# Altium schematic sheet COMMUNICATION_INTERFACE.SchDoc
size A3; SheetNumber: 5; SheetTotal: 6
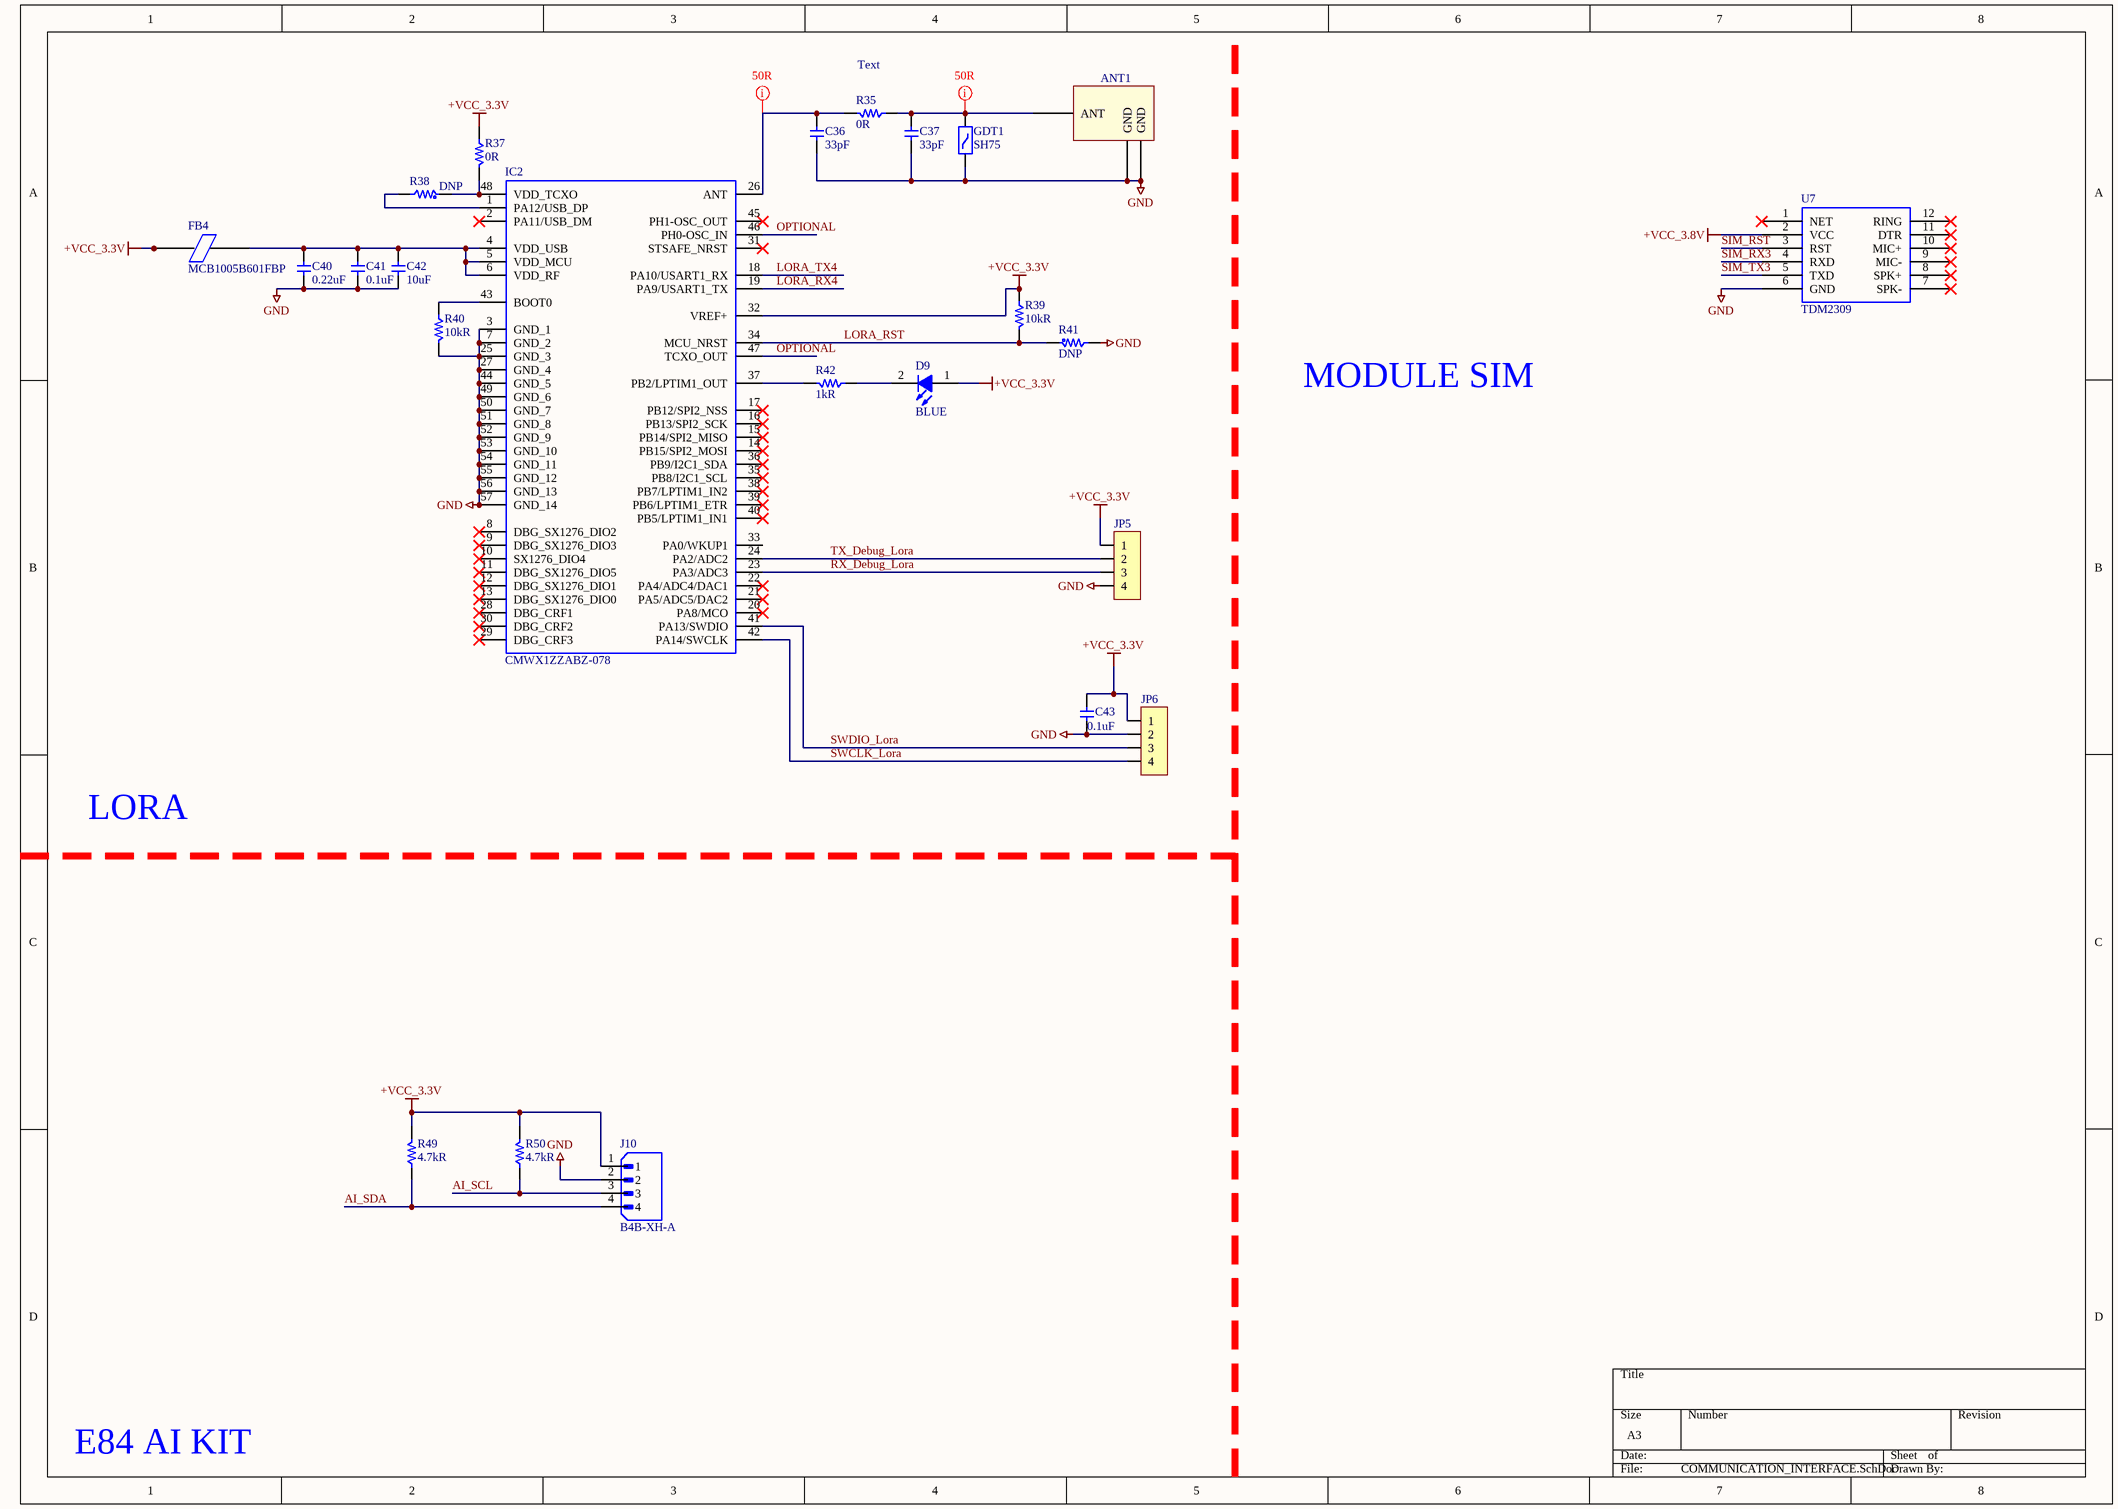
[diagram p0: COMMUNICATION_INTERFACE.SchDoc]

## Parts
ANT1  Anten SMD  [20279-001E-01]  (value not drawn)
C36  33pF  [CAP 0402 (1005)]
C37  33pF  [CAP 0402 (1005)]
C40  0.22uF  [CAP 0402 (1005)]
C41  0.1uF  [CAP 0402 (1005)]
C42  10uF  [CAP 0603 (1608)]
C43  0.1uF  [CAP 0402 (1005)]
D9  BLUE  [LED0402 BLUE]
FB4  MCB1005B601FBP  [FB 0402 (1005)]
GDT1  SH75  [GDT]
IC2  CMWX1ZZABZ-078  [CMWX1ZZABZ-078]
J10  B4B-XH-A  [JST_B4B-XH-A]
JP5  JP 1x4 2.54  [JP 1X4 DT]  (value not drawn)
JP6  JP 1x4 2.54  [JP 1X4 DT]  (value not drawn)
R35  0R  [RES 0603 (1608)]
R37  0R  [RES 0603 (1608)]
R38  DNP  [RES 0603 (1608)]
R39  10kR  [RES 0402 (1005)]
R40  10kR  [RES 0402 (1005)]
R41  DNP  [RES 0402 (1005)]
R42  1kR  [RES 0402 (1005)]
R49  4.7kR  [RES 0402 (1005)]
R50  4.7kR  [RES 0402 (1005)]
U7  TDM2309  [MODULE SIM SIM800L]

## Nets
+VCC_3.3V: C43.1 D9.1(A) FB4.1 IC2.32(VREF+) J10.1 JP5.1 JP6.1 R37.2 R39.2 R49.1 R50.1
+VCC_3.8V: U7.2(VCC)
GND: ANT1.1(GND) ANT1.3(GND) C36.2 C37.2 C40.2 C41.2 C42.2 C43.2 GDT1.1 IC2.3(GND_1) IC2.7(GND_2) IC2.25(GND_3) IC2.27(GND_4) IC2.44(GND_5) IC2.49(GND_6) IC2.50(GND_7) IC2.51(GND_8) IC2.52(GND_9) IC2.53(GND_10) IC2.54(GND_11) IC2.55(GND_12) IC2.56(GND_13) IC2.57(GND_14) J10.2 JP5.4 JP6.2 R40.1 R41.2 U7.6(GND)
AI_SCL: J10.3 R50.2
AI_SDA: J10.4 R49.2
LORA_RST: IC2.34(MCU_NRST) R39.1 R41.1
LORA_RX4: IC2.19(PA9/USART1_TX)
LORA_TX4: IC2.18(PA10/USART1_RX)
OPTIONAL: IC2.46(PH0-OSC_IN) IC2.47(TCXO_OUT)
RX_Debug_Lora: IC2.23(PA3/ADC3) JP5.3
SIM_RST: U7.3(RST)
SIM_RX3: U7.4(RXD)
SIM_TX3: U7.5(TXD)
SWCLK_Lora: IC2.42(PA14/SWCLK) JP6.4
SWDIO_Lora: IC2.41(PA13/SWDIO) JP6.3
TX_Debug_Lora: IC2.24(PA2/ADC2) JP5.2
NetANT1_2: ANT1.2(ANT) C37.1 GDT1.2 R35.2
NetC36_1: C36.1 IC2.26(ANT) R35.1
NetC40_1: C40.1 C41.1 C42.1 FB4.2 IC2.4(VDD_USB) IC2.5(VDD_MCU) IC2.6(VDD_RF)
NetD9_2: D9.2(K) R42.2
NetIC2_1: IC2.1(PA12/USB_DP) R38.2
NetIC2_37: IC2.37(PB2/LPTIM1_OUT) R42.1
NetIC2_43: IC2.43(BOOT0) R40.2
NetIC2_48: IC2.48(VDD_TCXO) R37.1 R38.1

Not connected (* = marked no-connect by the designer): IC2 2(PA11/USB_DM)* 8(DBG_SX1276_DIO2)* 9(DBG_SX1276_DIO3)* 10(SX1276_DIO4)* 11(DBG_SX1276_DIO5)* 12(DBG_SX1276_DIO1)* 13(DBG_SX1276_DIO0)* 14(PB15/SPI2_MOSI)* 15(PB14/SPI2_MISO)* 16(PB13/SPI2_SCK)* 17(PB12/SPI2_NSS)* 20(PA8/MCO)* 21(PA5/ADC5/DAC2)* 22(PA4/ADC4/DAC1)* 28(DBG_CRF1)* 29(DBG_CRF3)* 30(DBG_CRF2)* 31(STSAFE_NRST)* 33(PA0/WKUP1) 35(PB8/I2C1_SCL)* 36(PB9/I2C1_SDA)* 38(PB7/LPTIM1_IN2)* 39(PB6/LPTIM1_ETR)* 40(PB5/LPTIM1_IN1)* 45(PH1-OSC_OUT)*; U7 1(NET)* 7(SPK-)* 8(SPK+)* 9(MIC-)* 10(MIC+)* 11(DTR)* 12(RING)*

## Layout directives
mark named 50R: NetANT1_2, NetC36_1

## Notes on the sheet
- Text
- MODULE SIM
- LORA
- E84 AI KIT

## Library data of the parts
ANT1 = Antenna SMD
C36 C37 = CAP0402 33pF 50V: 50V 33pF NP0 ±5% 0402 Multilayer Ceramic Capacitors MLCC - SMD/SMT ROHS; Manufacturer: YAGEO; Manufacturer Part Number: CC0402JRNPO9BN330; Supplier: LCSC electronics; Unit Price: $0.001
C40 = CAP0402 0.22uF 35V: 35V 0.22uF X5R ±10% 0402 Multilayer Ceramic Capacitors MLCC - SMD/SMT ROHS; Manufacturer: Murata Electronics; Manufacturer Part Number: GRT155R6YA224KE01D; Supplier: LCSC electronics; Unit Price: US$ 0.0130
C41 C43 = CAP0402 0.1uF 50V: 50V 100nF ±10% 0402 Multilayer Ceramic Capacitors MLCC - SMD/SMT ROHS; Manufacturer: Samwha Capacitor; Manufacturer Part Number: CS1005X7R104K500NR; Supplier: LCSC electronics; Unit Price: $0.0017
C42 = CAP0603 10uF 25V: 25V 10uF X5R ±20% 0603 Multilayer Ceramic Capacitors MLCC - SMD/SMT ROHS; Manufacturer: Chinocera; Manufacturer Part Number: HGC0603R5106M250NTHJ; Supplier: LCSC electronics; Unit Price: $0.0199
D9 = LED BLUE 0402: blue 0402 Light Emitting Diodes (LED) ROHS; Manufacturer: BrtLed(Bright LED Elec); Manufacturer Part Number: BL-HB337A-AV-TRB; Supplier: LCSD electronics; Unit Price: $0.0178
FB4 = MCB1005B601FBP: 600mΩ ±25% 600Ω@100MHz 0402 Ferrite Beads ROHS; Manufacturer: INPAQ; Manufacturer Part Number: MCB1005B601FBP; Supplier: LCSD electronics; Unit Price: $0.0023
GDT1 = GDT 75V 5KA 2 POLE SURFACE MOUNT: Gas Discharge Tube 75 V 5000A (5kA) 2 Pole Surface Mount; Manufacturer: Littelfuse; Manufacturer Part Number: SH75; Supplier: Digikey; Unit Price: $1.61
IC2 = CMWX1ZZABZ-078: Integrated Circuit; Manufacturer_Name: Murata Electronics; Datasheet Link: http://www.mouser.com/ds/2/281/Murata_11172016_CMWX1ZZABZ-078-1063304.pdf; Manufacturer_Part_Number: CMWX1ZZABZ-078; Mouser Part Number: 81-CMWX1ZZABZ-078; Mouser Price/Stock: https://www.mouser.co.uk/ProductDetail/Murata-Electronics/CMWX1ZZABZ-078?qs=POvGejmMzm8lN1bzM2%2FdRQ%3D%3D; Arrow Part Number: CMWX1ZZABZ-078; Arrow Price/Stock: https://www.arrow.com/en/products/cmwx1zzabz-078/murata-manufacturing
J10 = B4B-XH-A: Connector Header Through Hole 4 position 0.098 (2.50mm); MF: JST Sales; SnapEDA_Link: https://www.snapeda.com/parts/B4B-XH-A/JST/view-part/?ref=snap; Package: None; Value: *; MP: B4B-XH-A; Check_prices: https://www.snapeda.com/parts/B4B-XH-A/JST/view-part/?ref=eda
JP5 JP6 = JP 1x4 2.54 Duc Thang: Cắm; Ten_Linh_Kien: Jump Đơn Đực 2.54MM 1x40P Thẳng 11MM; Don_Vi: Con; Ma_Hang: MH000903; Ghi_Chu: *; Kieu_Chan: *; Chung_Loai: Cắm
R35 R37 = RES0603 0R: 0Ω 0603 Chip Resistor - Surface Mount ROHS; Manufacturer: KOA Speer Elec; Manufacturer Part Number: RK73Z1JTTD; Supplier: LCSC electronics; Unit Price: $0.0048
R38 = RES0603 DNP: Res do not populate
R39 R40 = RES0402 10kR 1%: ±1% 10kΩ 0402 Chip Resistor - Surface Mount ROHS; Manufacturer: VO; Manufacturer Part Number: SCR0402F10K; Supplier: LCSC electronics; Unit Price: $0.0005
R41 = RES0402 DNP: Res do not populate
R42 R49 R50 = RES0402 1kR 1%: ±5% 1kΩ 0402 Chip Resistor - Surface Mount ROHS; Manufacturer: VO; Manufacturer Part Number: SCR0402J1K; Supplier: LCSC electronics; Unit Price: $0.0004
U7 = SIM TDM2309: Module 4G SIMCOM A7680C TDM2309; Manufacturer: SIMCOM; Manufacturer Part Number: TDM2309; Supplier: https://linhkienthuduc.com/; Unit Price: 189.000VND